# Altium schematic sheet accelerometer.SchDoc: Ultrasonic
size Letter; Author: Kuo, Huang; Revision: 2.0; SheetNumber: 7; SheetTotal: 7
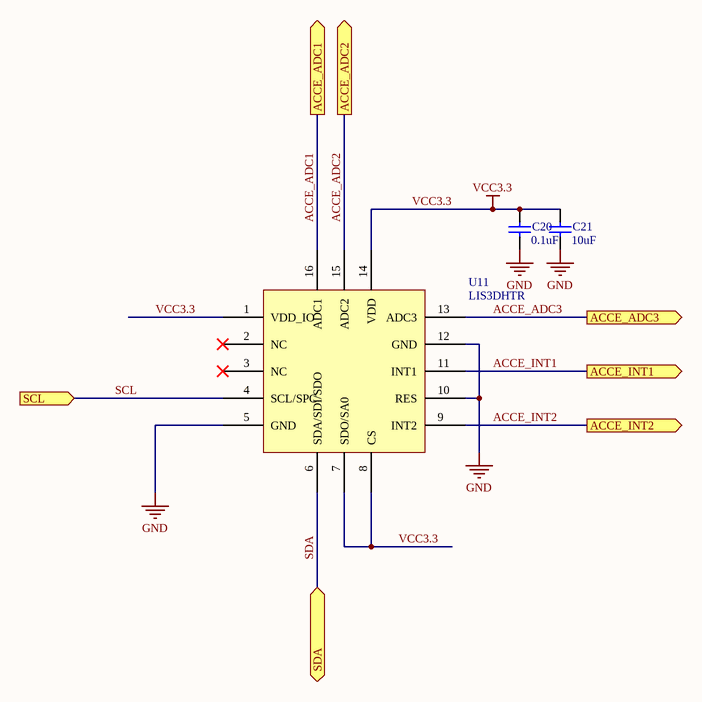
[diagram p0: accelerometer.SchDoc]

## Parts
C20  value 0.1uF  [1608[0603]]  (hidden comment: Cap Semi)
C21  value 10uF  [1608[0603]]  (hidden comment: Cap Semi)
U11  LIS3DHTR  [LGA-16]

## Ports
ACCE_ADC1 (out), ACCE_ADC2 (out), ACCE_ADC3 (out), ACCE_INT1 (out), ACCE_INT2 (out), SCL (in), SDA (bidir)

## Nets
GND: C20.1 C21.1 U11.5(GND) U11.10(RES) U11.12(GND)
VCC3.3: C20.2 C21.2 U11.1(VDD_IO) U11.7(SDO/SA0) U11.8(CS) U11.14(VDD)
ACCE_ADC1: U11.16(ADC1) ; port ACCE_ADC1
ACCE_ADC2: U11.15(ADC2) ; port ACCE_ADC2
ACCE_ADC3: U11.13(ADC3) ; port ACCE_ADC3
ACCE_INT1: U11.11(INT1) ; port ACCE_INT1
ACCE_INT2: U11.9(INT2) ; port ACCE_INT2
SCL: U11.4(SCL/SPC) ; port SCL
SDA: U11.6(SDA/SDI/SDO) ; port SDA

Not connected (* = marked no-connect by the designer): U11 2(NC)* 3(NC)*

## Notes on the sheet
- Title
- Date:
- Author:
- Revision:
- Sheet
- of
- University of Michigan
- File:

## Library data of the parts
C20 C21 = Cap Semi: Capacitor (Semiconductor SIM Model); Published: 8-Jun-2000; LatestRevisionDate: 29-May-2009; LatestRevisionNote: IPC-7351 Footprint Added.; PackageReference: C1206; Publisher: Altium Limited; PackageDescription: Chip Capacitor
U11 = LIS3DHTR: MEMS digital output motion sensor; Supplier 1: Digi-Key; Supplier Part Number 1: 497-10613-6-ND